# Altium schematic sheet main.SchDoc
size A
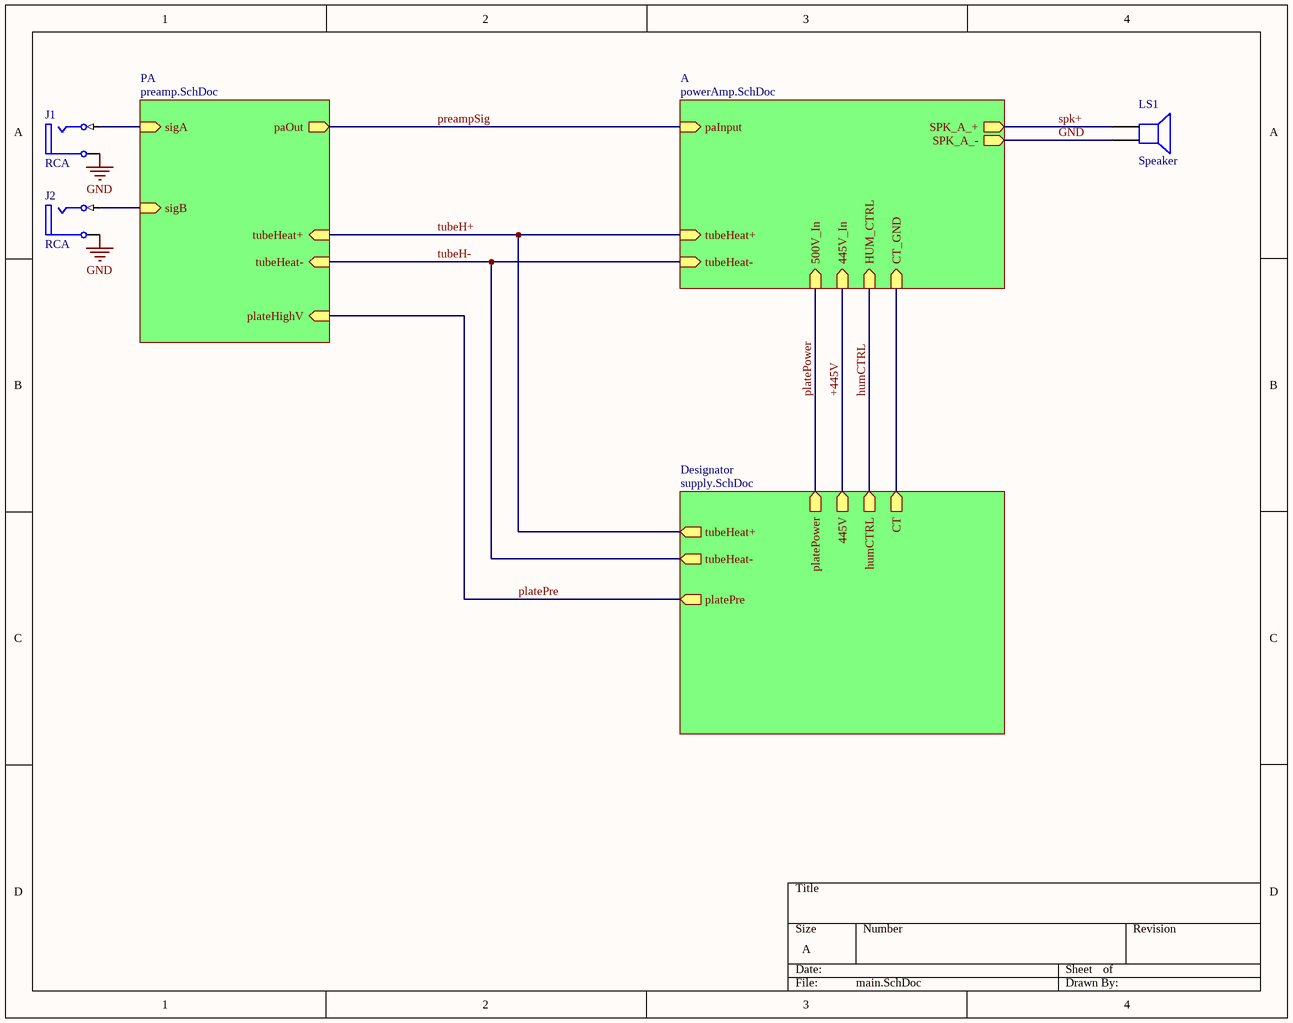
[diagram p0: main.SchDoc]

## Parts
J1  RCA  [RCA/4.5-H2]
J2  RCA  [RCA/4.5-H2]
LS1  Speaker  [PIN2]

## Sub-sheets
A = powerAmp.SchDoc: paInput (in), 445V_In (in), tubeHeat+ (in), tubeHeat- (in), 500V_In (in), HUM_CTRL (in), CT_GND (in), SPK_A_+ (out), SPK_A_- (out)
Designator = supply.SchDoc: platePre (out), platePower (out), 445V (out), tubeHeat+ (out), humCTRL (out), tubeHeat- (out), CT (out)
PA = preamp.SchDoc: sigA (in), sigB (in), paOut (out), plateHighV (in), tubeHeat+ (in), tubeHeat- (in)

## Nets
GND: J1.1A(Ground) J2.1A(Ground) LS1.2 ; sheet A/SPK_A_-
+445V: sheet A/445V_In, sheet Designator/445V
humCTRL: sheet A/HUM_CTRL, sheet Designator/humCTRL
platePower: sheet A/500V_In, sheet Designator/platePower
platePre: sheet PA/plateHighV, sheet Designator/platePre
preampSig: sheet PA/paOut, sheet A/paInput
spk+: LS1.1 ; sheet A/SPK_A_+
tubeH+: sheet PA/tubeHeat+, sheet A/tubeHeat+, sheet Designator/tubeHeat+
tubeH-: sheet PA/tubeHeat-, sheet A/tubeHeat-, sheet Designator/tubeHeat-
NetJ1_2B: J1.2B(Signal) ; sheet PA/sigA
NetJ2_2B: J2.2B(Signal) ; sheet PA/sigB
(unnamed): sheet A/CT_GND, sheet Designator/CT

## Library data of the parts
J1 J2 = RCA: RCA Phono Jack, Right Angle, Thru-Hole, Snap-In; PCB_Layout: Complies with manufacturer's recommendation.; DrillAndSlotSize: Corresponds to nominal value.; Published: 15-Jul-2004; LatestRevisionDate: 15-Jul-2004; LatestRevisionNote: Component Replaced.; DatasheetDocument: 7-Jul-2000; PackageDocument: 7-Jul-2000; PackageReference: 161; Publisher: Altium Limited; ComponentLink1Description: Manufacturer Link; ComponentLink1URL: http://www.mouser.com/kobiconn/
LS1 = Speaker: Loudspeaker; Published: 24-Mar-1999; LatestRevisionDate: 17-Jul-2002; LatestRevisionNote: Re-released for DXP Platform.; PackageReference: PIN2; Publisher: Altium Limited